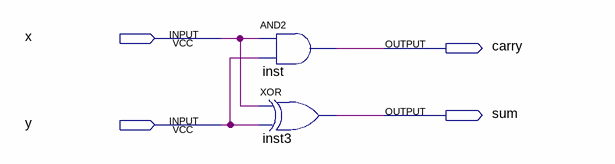
[diagram p0: schematic sheet]
// Quartus schematic halfadder.bdf as structural Verilog: 2 symbols, 4 pins
module halfadder (
  input  x,
  input  y,
  output carry,
  output sum
);

  and inst (carry, x, y);
  xor inst3 (sum, x, y);
endmodule
